# EAGLE design pid driver (EAGLE 9.5.1)

## Sheet 1 of 2
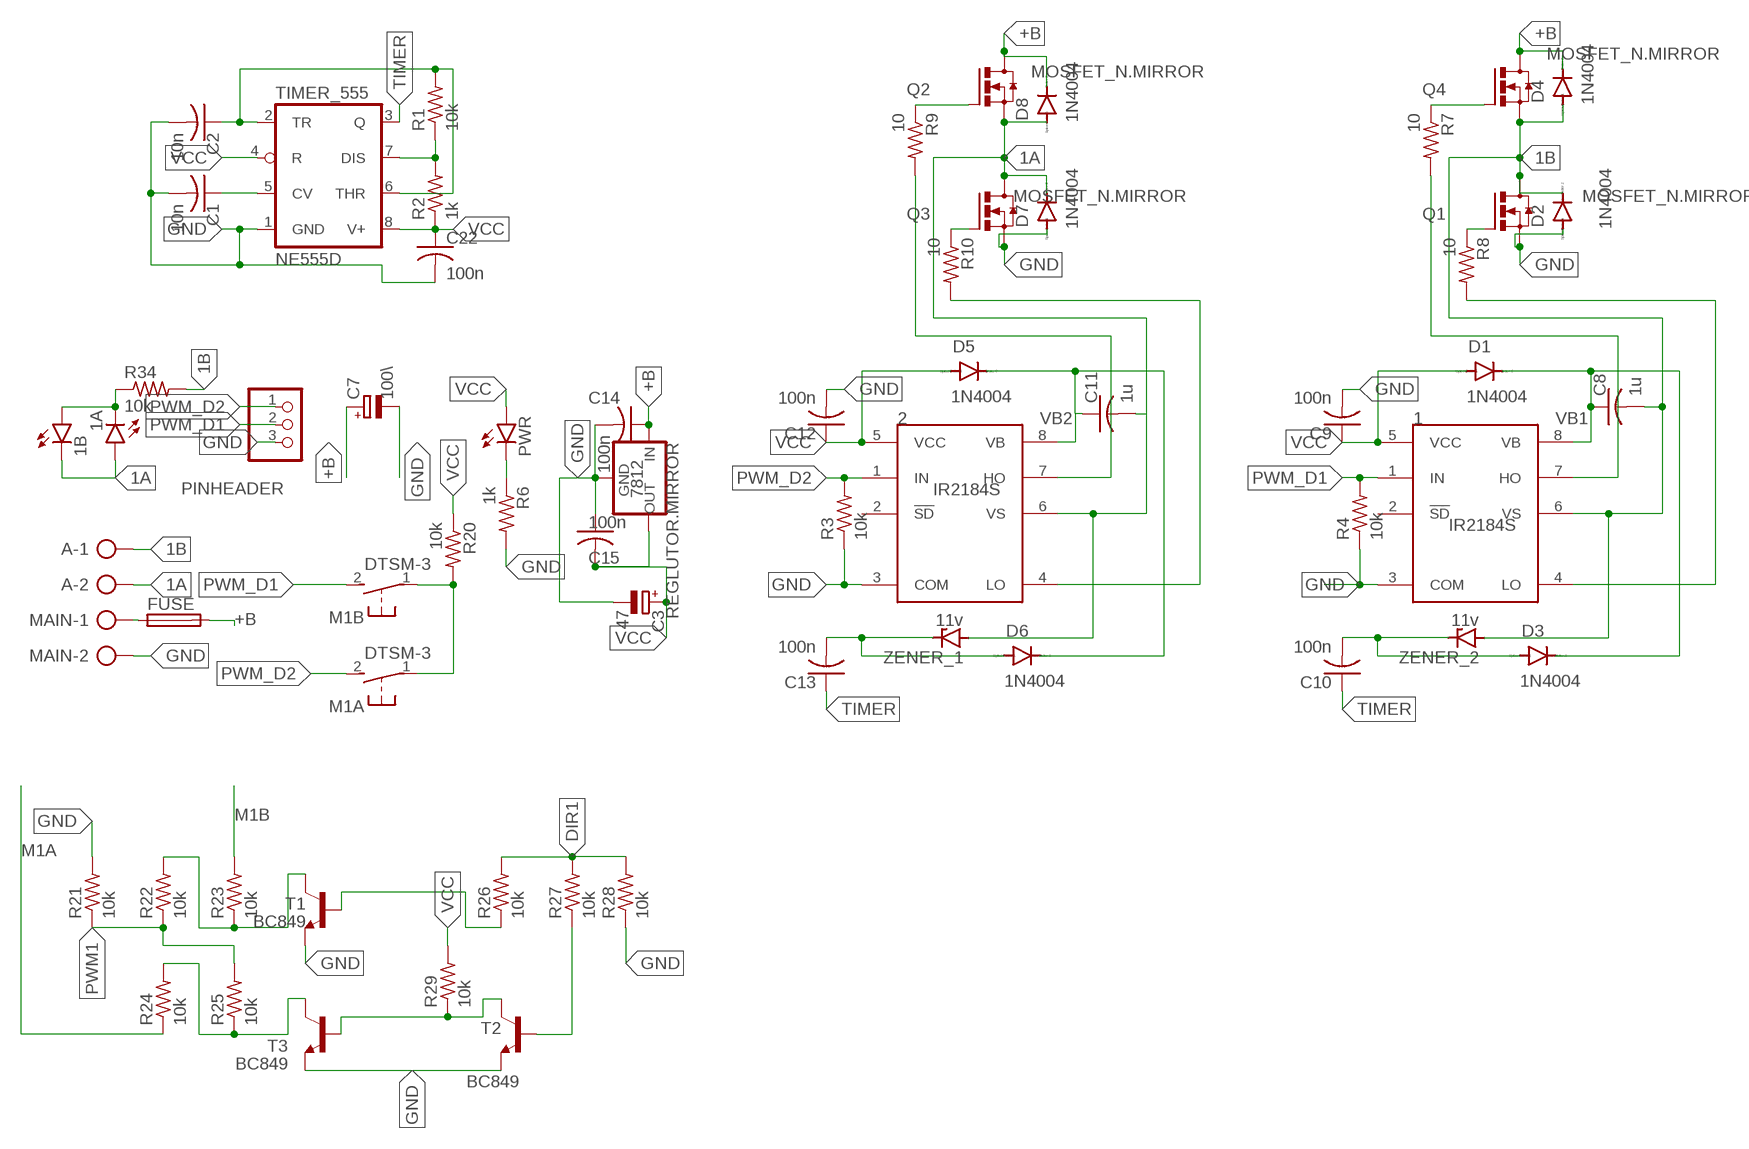
[diagram p0: schematic, sheet 1]

### Parts
1  IR2184S  [SO08]
1A  LEDCHIPLED_1206  [CHIPLED_1206]
1B  LEDCHIPLED_1206  [CHIPLED_1206]
2  IR2184S  [SO08]
7812  REGLUTOR.MIRROR  [78XXL.MIRROR]
A  AK300/22  [XTALRR488W60L1090T465H350B]
C1  10n  C-USC1206K  [C1206K]
C2  10n  C-USC1206K  [C1206K]
C3  47  CPOL-EUE5-10.5  [E5-10,5]
C7  100\  CPOL-EUE5-10.5  [E5-10,5]
C8  1u  C-USC1206K  [C1206K]
C9  100n  C-USC1206K  [C1206K]
C10  100n  C-USC1206K  [C1206K]
C11  1u  C-USC1206K  [C1206K]
C12  100n  C-USC1206K  [C1206K]
C13  100n  C-USC1206K  [C1206K]
C14  100n  C-USC1206K  [C1206K]
C15  100n  C-USC1206K  [C1206K]
C22  100n  C-USC1206K  [C1206K]
D1  1N4004  [DO41-10]
D2  1N4004  [DO41-10]
D3  1N4004  [DO41-10]
D4  1N4004  [DO41-10]
D5  1N4004  [DO41-10]
D6  1N4004  [DO41-10]
D7  1N4004  [DO41-10]
D8  1N4004  [DO41-10]
FUSE  FUSE_HOLDER  [SH22,5A]
M1A  DTSM-3  [DTSM-3]
M1B  DTSM-3  [DTSM-3]
MAIN  AK300/22  [XTALRR488W60L1090T465H350B]
PINHEADER  PINHD-1X3  [1X03]
PWR  LEDCHIPLED_1206  [CHIPLED_1206]
Q1  MOSFET_N.MIRROR  [TO220.MIRROR]
Q2  MOSFET_N.MIRROR  [TO220.MIRROR]
Q3  MOSFET_N.MIRROR  [TO220.MIRROR]
Q4  MOSFET_N.MIRROR  [TO220.MIRROR]
R1  10k  R-US_M1206  [M1206]
R2  1k  R-US_M1206  [M1206]
R3  10k  R-US_M1206  [M1206]
R4  10k  R-US_M1206  [M1206]
R6  1k  R-US_M1206  [M1206]
R7  10  R-US_M1206  [M1206]
R8  10  R-US_M1206  [M1206]
R9  10  R-US_M1206  [M1206]
R10  10  R-US_M1206  [M1206]
R20  10k  R-US_M1206  [M1206]
R21  10k  R-US_R1206  [R1206]
R22  10k  R-US_R1206  [R1206]
R23  10k  R-US_R1206  [R1206]
R24  10k  R-US_R1206  [R1206]
R25  10k  R-US_R1206  [R1206]
R26  10k  R-US_R1206  [R1206]
R27  10k  R-US_R1206  [R1206]
R28  10k  R-US_R1206  [R1206]
R29  10k  R-US_R1206  [R1206]
R34  10k  R-US_M1206  [M1206]
T1  BC849  [SOT23]
T2  BC849  [SOT23]
T3  BC849  [SOT23]
TIMER_555  NE555D  [SO08]
ZENER_1  11v  BZD23  [SOD81]
ZENER_2  11v  BZD23  [SOD81]

### Nets
1A: 1A.A 1B.C 2.6(VS) A.2 C11.2 D7.C D8.A Q2.S Q3.D ZENER_1.A
1B: 1.6(VS) A.1 C8.2 D2.C D4.A Q1.D Q4.S R34.2 ZENER_2.A
+B: 7812.IN C7.+ C14.1 D4.C D8.C FUSE.2 Q2.D Q4.D
DIR1: R26.2 R27.2 R28.2
GND: 1.3(COM) 2.3(COM) 7812.GND C1.2 C2.2 C3.- C7.- C9.2 C12.2 C14.2 C15.1 C22.2 D2.A D7.A MAIN.2 PINHEADER.3 Q1.S Q3.S R3.1 R4.1 R6.2 R21.2 R28.1 T1.2(E) T2.2(E) T3.2(E) TIMER_555.1(GND)
M1A: R24.1
M1B: R23.2
N$1: PWR.C R6.1
N$2: C1.1 TIMER_555.5(CV)
N$3: R1.1 R2.2 TIMER_555.7(DIS)
N$4: C2.1 R1.2 TIMER_555.2(TR) TIMER_555.6(THR)
N$7: M1A.1 M1B.1 R20.2
N$9: Q4.G R7.1
N$10: Q1.G R8.1
N$12: 1.4(LO) R8.2
N$13: 1.7(HO) R7.2
N$14: C10.2 D3.A ZENER_2.C
N$15: Q3.G R10.1
N$16: Q2.G R9.1
N$17: 2.4(LO) R10.2
N$18: 2.7(HO) R9.2
N$20: C13.2 D6.A ZENER_1.C
N$22: FUSE.1 MAIN.1
N$24: R24.2 R25.1 T3.3(C)
N$25: R22.2 R23.1 T1.3(C)
N$26: R26.1 T1.1(B)
N$27: R29.1 T2.3(C) T3.1(B)
N$28: R27.1 T2.1(B)
N$45: 1A.C 1B.A R34.1
PWM1: R21.1 R22.1 R25.2
PWM_D1: 1.1(IN) M1B.2 PINHEADER.2 R4.2 ; also sheet 2
PWM_D2: 2.1(IN) M1A.2 PINHEADER.1 R3.2 ; also sheet 2
TIMER: C10.1 C13.1 TIMER_555.3(Q)
VB1: 1.8(VB) C8.1 D1.C D3.C
VB2: 2.8(VB) C11.1 D5.C D6.C
VCC: 1.5(VCC) 2.5(VCC) 7812.OUT C3.+ C9.1 C12.1 C15.2 C22.1 D1.A D5.A PWR.A R2.1 R20.1 R29.2 TIMER_555.4(R) TIMER_555.8(V+)
Unconnected: 1.2(!SD) 2.2(!SD)

## Sheet 2 of 2
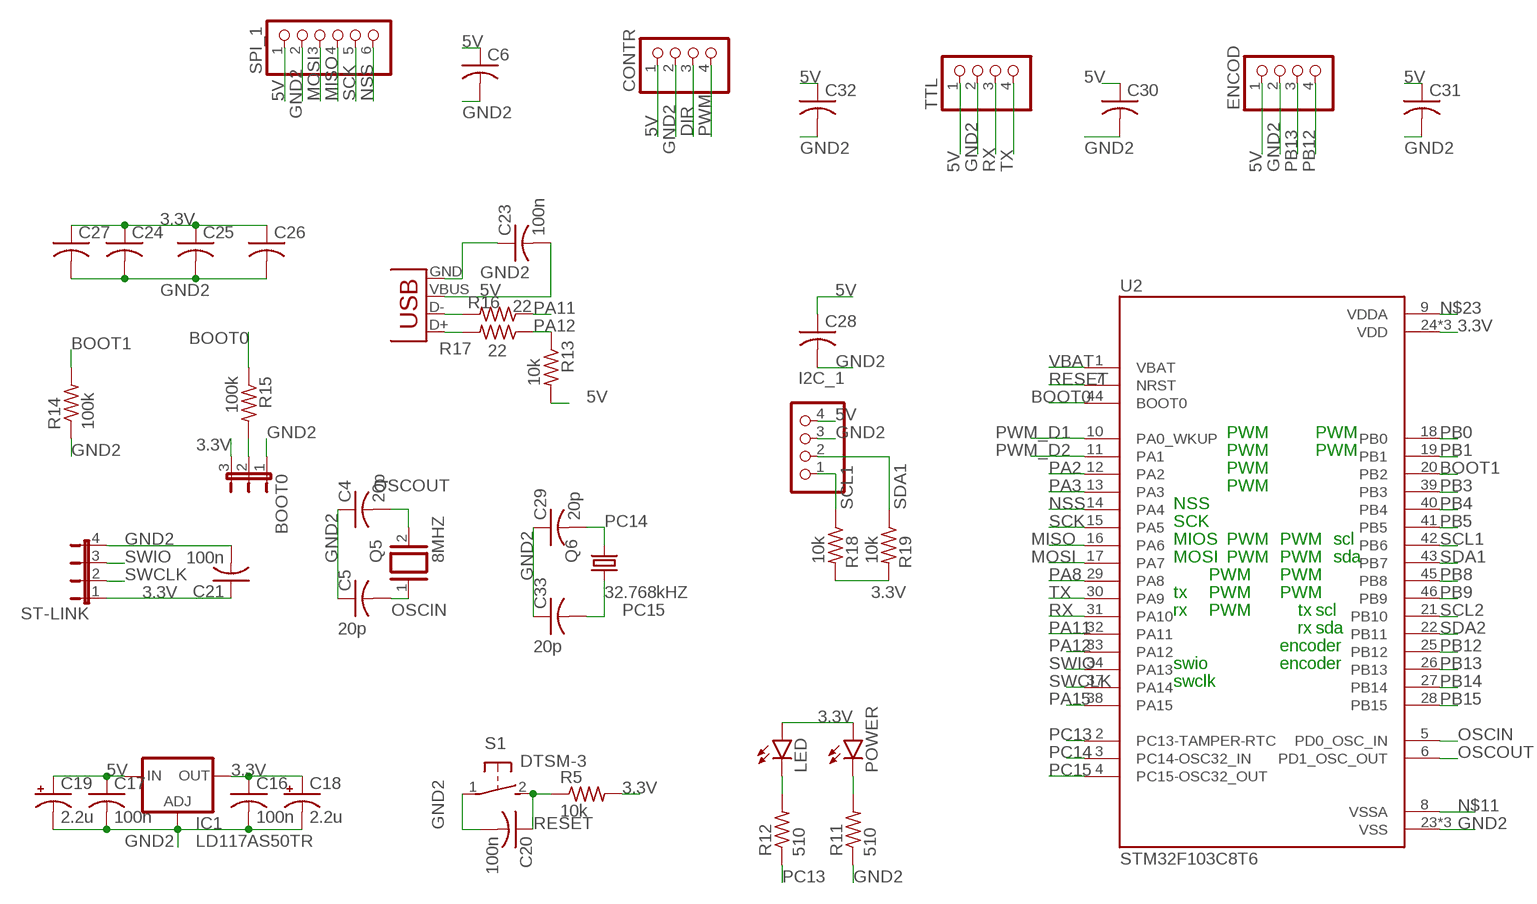
[diagram p1: schematic, sheet 2]

### Parts
BOOT0  JP2E  [JP2]
C4  20p  C-USC1206  [C1206]
C5  20p  C-USC1206  [C1206]
C6  C-USC1206  [C1206]
C16  100n  C-USC1206  [C1206]
C17  100n  C-USC1206  [C1206]
C18  2.2u  CPOL-USE2-5  [E2-5]
C19  2.2u  CPOL-USE2-5  [E2-5]
C20  100n  C-USC1206  [C1206]
C21  100n  C-USC1206  [C1206]
C23  100n  C-USC1206  [C1206]
C24  C-USC1206  [C1206]
C25  C-USC1206  [C1206]
C26  C-USC1206  [C1206]
C27  C-USC1206  [C1206]
C28  C-USC1206  [C1206]
C29  20p  C-USC1206  [C1206]
C30  C-USC1206  [C1206]
C31  C-USC1206  [C1206]
C32  C-USC1206  [C1206]
C33  20p  C-USC1206  [C1206]
CONTR  PINHD-1X4  [1X04]
ENCOD  PINHD-1X4  [1X04]
I2C_1  PINHD-1X4  [1X04]
IC1  LD117AS50TR  [SOT223]
LED  LEDCHIPLED_1206  [CHIPLED_1206]
POWER  LEDCHIPLED_1206  [CHIPLED_1206]
Q5  8MHZ  XTAL/S  [QS]
Q6  32.768kHZ  CRYSTALTC26H  [TC26H]
R5  10k  R-US_R1206  [R1206]
R11  510  R-US_R1206  [R1206]
R12  510  R-US_R1206  [R1206]
R13  10k  R-US_R1206  [R1206]
R14  100k  R-US_R1206  [R1206]
R15  100k  R-US_R1206  [R1206]
R16  22  R-US_R1206  [R1206]
R17  22  R-US_R1206  [R1206]
R18  10k  R-US_R1206  [R1206]
R19  10k  R-US_R1206  [R1206]
S1  DTSM-3  [DTSM-3]
SPI_1  PINHD-1X6  [1X06]
ST-LINK  JP4E  [JP4]
TTL  PINHD-1X4  [1X04]
U2  STM32F103C8T6  [QFP50P900X900X160-48N]
X1  USB-MB-S  [USB-MB-S]

### Nets
3.3V: BOOT0.3 C16.1 C18.+ C21.1 C24.1 C25.1 C26.1 C27.1 IC1.4(OUT) LED.A POWER.A R5.2 R18.2 R19.2 ST-LINK.1 U2.24(VDD) U2.36(VDD) U2.48(VDD)
5V: C6.1 C17.1 C19.+ C23.2 C28.1 C30.1 C31.1 C32.1 CONTR.1 ENCOD.1 I2C_1.4 IC1.3(IN) R13.2 SPI_1.1 TTL.1 X1.VBUS
BOOT0: R15.1 U2.44(BOOT0)
BOOT1: R14.2 U2.20(PB2)
DIR: CONTR.3
GND2: BOOT0.1 C4.1 C5.1 C6.2 C16.2 C17.2 C18.- C19.- C20.2 C21.2 C23.1 C24.2 C25.2 C26.2 C27.2 C28.2 C29.1 C30.2 C31.2 C32.2 C33.1 CONTR.2 ENCOD.2 I2C_1.3 IC1.1(ADJ) R11.1 R14.1 S1.1 SPI_1.2 ST-LINK.4 TTL.2 U2.23(VSS) U2.35(VSS) U2.47(VSS) X1.GND
MISO: SPI_1.4 U2.16(PA6)
MOSI: SPI_1.3 U2.17(PA7)
N$5: LED.C R12.2
N$6: POWER.C R11.2
N$8: BOOT0.2 R15.2
N$11: U2.8(VSSA)
N$19: R16.2 X1.D-
N$21: R17.2 X1.D+
N$23: U2.9(VDDA)
NSS: SPI_1.6 U2.14(PA4)
OSCIN: C5.2 Q5.1 U2.5(PD0_OSC_IN)
OSCOUT: C4.2 Q5.2 U2.6(PD1_OSC_OUT)
PA2: U2.12(PA2)
PA3: U2.13(PA3)
PA8: U2.29(PA8)
PA11: R16.1 U2.32(PA11)
PA12: R13.1 R17.1 U2.33(PA12)
PA15: U2.38(PA15)
PB0: U2.18(PB0)
PB1: U2.19(PB1)
PB3: U2.39(PB3)
PB4: U2.40(PB4)
PB5: U2.41(PB5)
PB8: U2.45(PB8)
PB9: U2.46(PB9)
PB12: ENCOD.4 U2.25(PB12)
PB13: ENCOD.3 U2.26(PB13)
PB14: U2.27(PB14)
PB15: U2.28(PB15)
PC13: R12.1 U2.2(PC13-TAMPER-RTC)
PC14: C29.2 Q6.2 U2.3(PC14-OSC32_IN)
PC15: C33.2 Q6.1 U2.4(PC15-OSC32_OUT)
PWM: CONTR.4
PWM_D1: U2.10(PA0_WKUP) ; also sheet 1
PWM_D2: U2.11(PA1) ; also sheet 1
RESET: C20.1 R5.1 S1.2 U2.7(NRST)
RX: TTL.3 U2.31(PA10)
SCK: SPI_1.5 U2.15(PA5)
SCL1: I2C_1.1 R18.1 U2.42(PB6)
SCL2: U2.21(PB10)
SDA1: I2C_1.2 R19.1 U2.43(PB7)
SDA2: U2.22(PB11)
SWCLK: ST-LINK.2 U2.37(PA14)
SWIO: ST-LINK.3 U2.34(PA13)
TX: TTL.4 U2.30(PA9)
VBAT: U2.1(VBAT)

### Notes on the sheet
- PWM | PWM
- PWM | PWM
- PWM
- PWM
- NSS
- SCK
- MIOS | PWM | PWM | scl
- MOSI | PWM | PWM | sda
- PWM | PWM
- tx | PWM | PWM
- rx | PWM | tx | scl
- rx | sda
- encoder
- swio | encoder
- swclk

## Library data of the parts
1 2 = irs:IR2184
1A 1B LED POWER PWR = led:LED: LED OSRAM: - CHIPLED LG R971, LG N971, LY N971, LG Q971, LY Q971, LO R971, LY R971 LH N974, LH R974 LS Q976, LO Q976, LY Q976 LO Q996 - Hyper CHIPLED LW Q18S LB Q993, LB Q99A, LB R99A - SideLED LS A670, LO A670, LY A670, LG A670, LP A670 LB A673, LV A673, LT A673, LW A673 LH A674 LY A675 LS A676, LA A676, LO A676, LY A676, LW A676 LS A679, LY A679, LG A679 - Hyper Micro SIDELED® LS Y876, LA Y876, LO Y876, LY Y876 LT Y87S - SmartLED LW L88C, LW L88S LB L89C, LB L89S, LG L890 LS L89K, LO L89K, LY L89K LS L896, LA L896, LO L896, LY L896 - TOPLED LS T670, LO T670, LY T670, LG T670, LP T670 LSG T670, LSP T670, LSY T670, LOP T670, LYG T670 LG T671, LOG T671, LSG T671 LB T673, LV T673, LT T673, LW T673 LH T674 LS T676, LA T676, LO T676, LY T676, LB T676, LH T676, LSB T676, LW T676 LB T67C, LV T67C, LT T67C, LS T67K, LO T67K, LY T67K, LW E67C LS E67B, LA E67B, LO E67B, LY E67B, LB E67C, LV E67C, LT E67C LW T67C LS T679, LY T679, LG T679 LS T770, LO T770, LY T770, LG T770, LP T770 LB T773, LV T773, LT T773, LW T773 LH T774 LS E675, LA E675, LY E675, LS T675 LS T776, LA T776, LO T776, LY T776, LB T776 LHGB T686 LT T68C, LB T68C - Hyper Mini TOPLED® LB M676 - Mini TOPLED Santana® LG M470 LS M47K, LO M47K, LY M47K Source: http://www.osram.convergy.de LUXEON: - LUMILED® LXK2-PW12-R00, LXK2-PW12-S00, LXK2-PW14-U00, LXK2-PW14-V00 LXK2-PM12-R00, LXK2-PM12-S00, LXK2-PM14-U00 LXK2-PE12-Q00, LXK2-PE12-R00, LXK2-PE12-S00, LXK2-PE14-T00, LXK2-PE14-U00 LXK2-PB12-K00, LXK2-PB12-L00, LXK2-PB12-M00, LXK2-PB14-N00, LXK2-PB14-P00, LXK2-PB14-Q00 LXK2-PR12-L00, LXK2-PR12-M00, LXK2-PR14-Q00, LXK2-PR14-R00 LXK2-PD12-Q00, LXK2-PD12-R00, LXK2-PD12-S00 LXK2-PH12-R00, LXK2-PH12-S00 LXK2-PL12-P00, LXK2-PL12-Q00, LXK2-PL12-R00 Source: www.luxeon.com KINGBRIGHT: KA-3528ASYC Source: www.kingbright.com
7812 = MOSFET MIRROR:REGLUTOR.MIRROR
A MAIN = con-ptr50056:AK300/2: CONNECTOR
BOOT0 = jumper:JP2E: JUMPER
C1 C2 C4-C6 C8-C17 C20-C33 = rcl:C-US: CAPACITOR, American symbol; SPICEPREFIX: C
C3 C7 = rcl8:CPOL-EU: POLARIZED CAPACITOR, European symbol; SPICEPREFIX: C
C18 C19 = rcl:CPOL-US: POLARIZED CAPACITOR, American symbol; SPICEPREFIX: C
CONTR ENCOD TTL = MIA_LIBRARY (2):PINHD-1X4: PIN HEADER
D1-D8 = diode:1N4004: DIODE general purpose rectifier, 1 A
FUSE = MIA_LIBRARY (2):FUSE_HOLDER
I2C_1 = pinhead:PINHD-1X4: PIN HEADER
IC1 = v-reg:LD117A?*: Low drop fixed and adjustable positive voltage regulators 1 A Source: http://www.st.com/stonline/products/literature/ds/7194/ld1117axx.pdf
M1A M1B S1 = switch-tact:DTSM-3
PINHEADER = pinhead:PINHD-1X3: PIN HEADER
Q1-Q4 = MIA_LIBRARY (5):MOSFET_N.MIRROR
Q5 = special:XTAL/S: CRYSTAL
Q6 = crystal:CRYSTAL: CRYSTAL; OC_FARNELL: unknown; OC_NEWARK: unknown
R1-R29 R34 = rcl:R-US_: RESISTOR, American symbol; SPICEPREFIX: R
SPI_1 = pinhead:PINHD-1X6: PIN HEADER
ST-LINK = jumper:JP4E: JUMPER
T1-T3 = transistor-neu-to92:BC849: NPN TRANSISTOR
TIMER_555 = linear:*555: TIMER
U2 = STM32F103C8T6:STM32F103C8T6: Mainstream Performance line, ARM Cortex-M3 MCU with 64 Kbytes Flash, 72 MHz CPU, motor control, USB and CAN; AVAILABILITY: Unavailable; DESCRIPTION: Mainstream Performance line, ARM Cortex-M3 MCU with 64 Kbytes Flash, 72 MHz CPU, motor control, USB and CAN; MF: STMicroelectronics; MP: STM32F103C8T6; PACKAGE: LQFP-48 STMicroelectronics; PRICE: None
X1 = MIA_LIBRARY (2):USB: USB Connectors
ZENER_1 ZENER_2 = diode:BZD23: Z DIODE

## Board
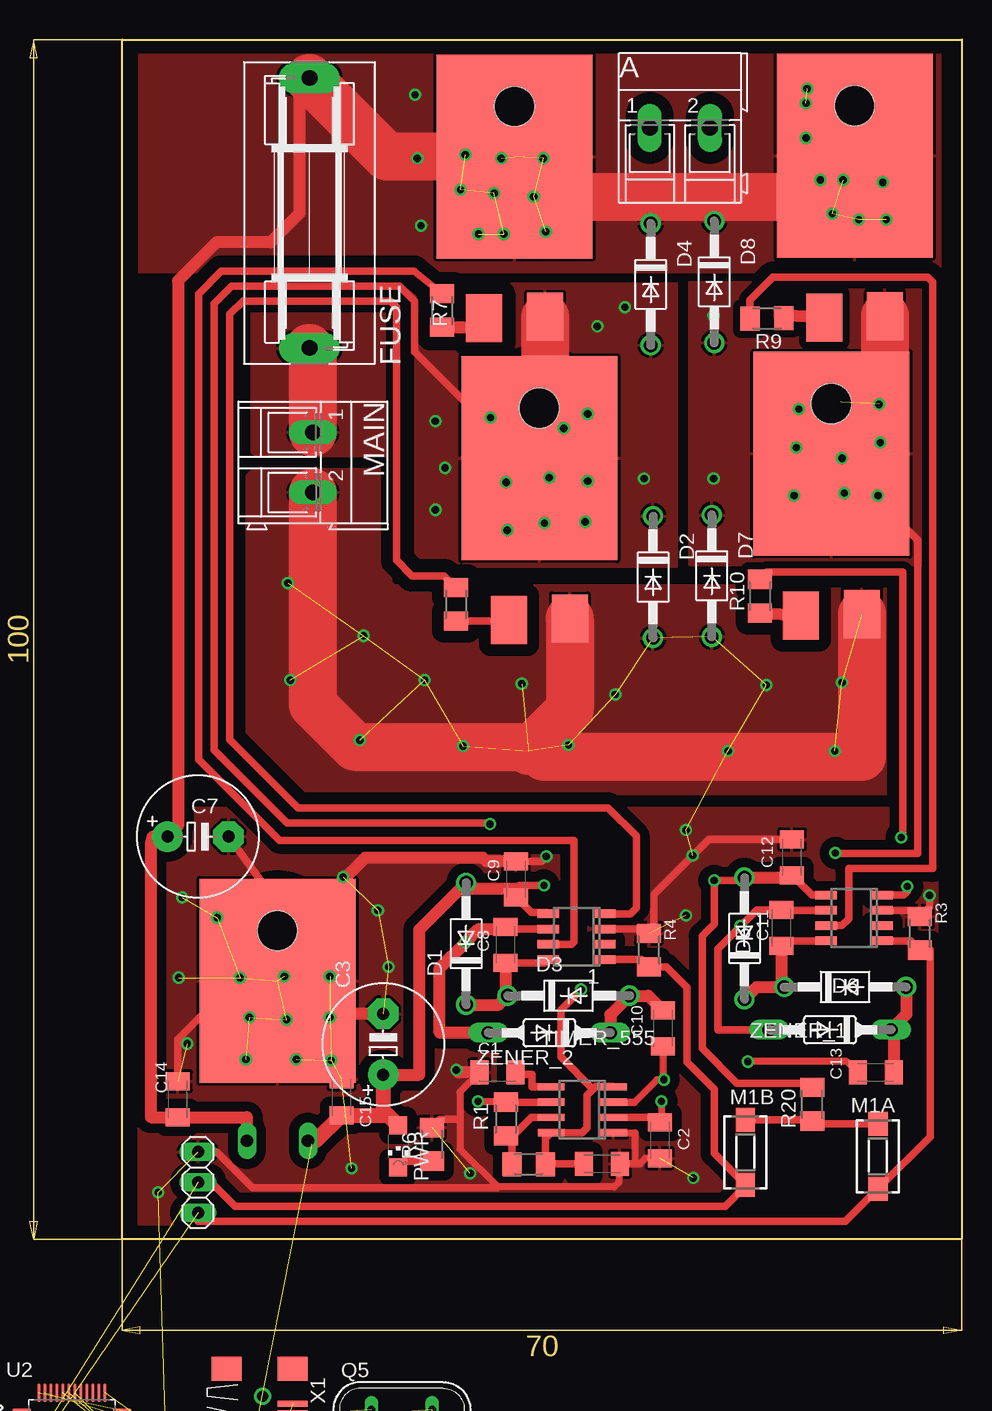
[diagram p2: board, top side]
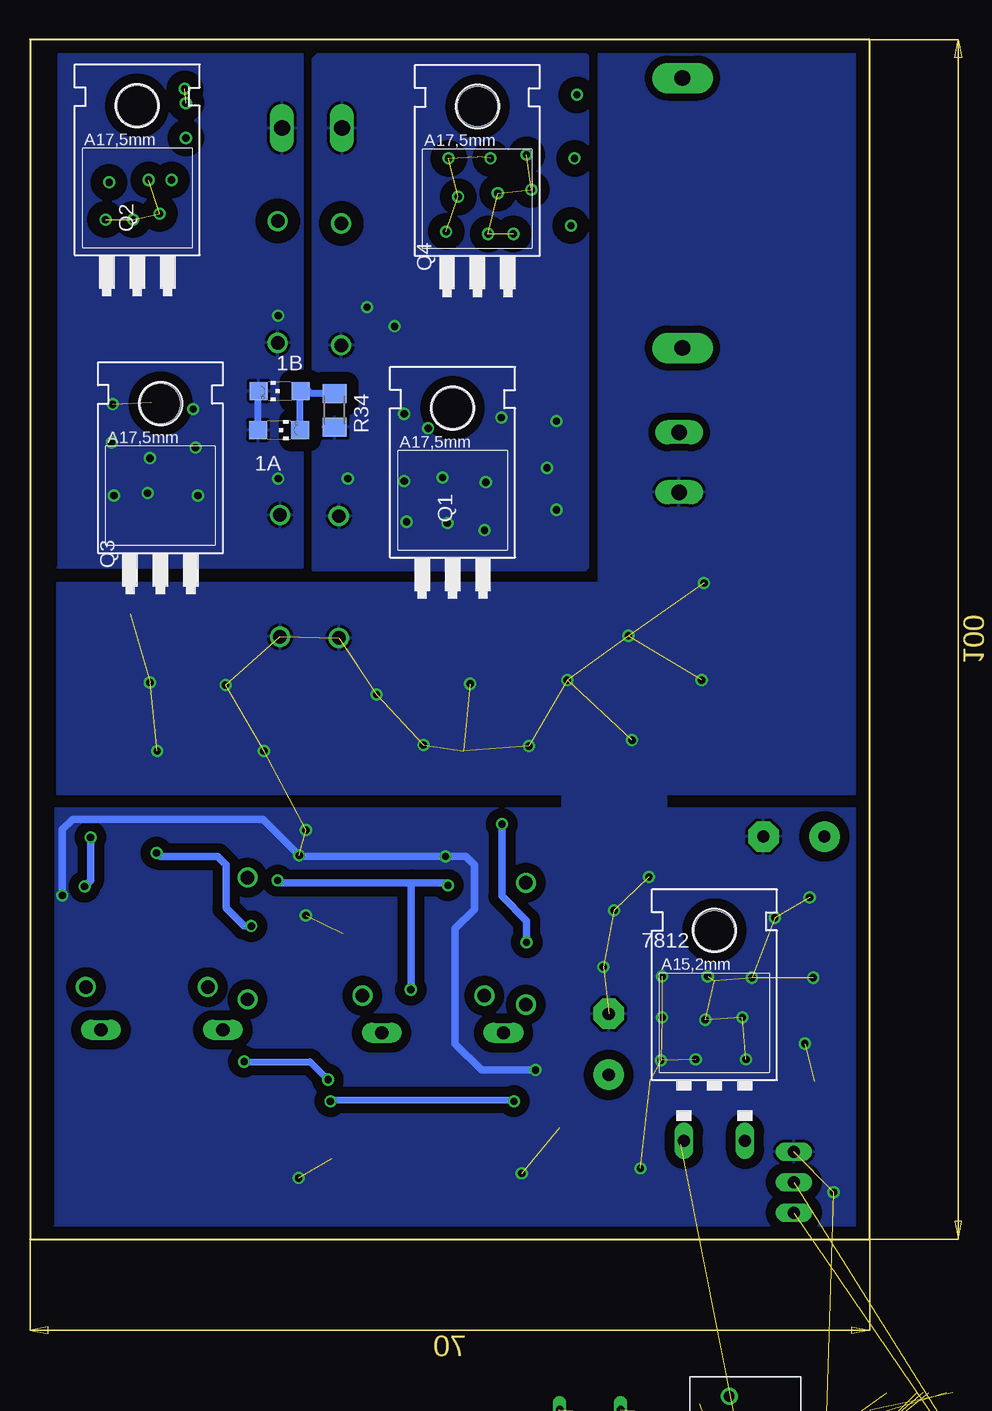
[diagram p3: board, bottom side, seen from below]

Size 70 x 100 mm. Coordinates in mm from the lower left corner, seen from the top.
Outline: 0,0 0,100 70,100 70,0 0,0
Copper layers (1*16): Top 0.035mm / dielectric 1.5mm / Bottom 0.035mm
Design rules "default *": minimum track width 0.015240625mm, minimum drill 0.8mm, track to track 0.6mm, track to pad 0.6mm, pad to pad 0.4mm, via to via 6mil, smd to smd 6mil, copper to edge 40mil, drill to drill 6mil, minimum pad ring 10mil, minimum via ring 8mil, stop-mask expansion 4mil, vias tented up to drill 0mil, thermal gap 10mil

### Footprints (pad centres in the part's own frame; a part is rotated, then mirrored left to right if it is on the bottom)
SO08 = smd 0.72 x 1.78: 1 -1.905,-2.35; 2 -0.635,-2.35; 3 0.635,-2.35; 4 1.905,-2.35; 5 1.905,2.35; 6 0.635,2.35; 7 -0.635,2.35; 8 -1.905,2.35
CHIPLED_1206 = smd 1.5 x 1.5: A 0,-1.75; C 0,1.75
78XXL.MIRROR = smd 13 x 17 bottom: GND 0,7 | drill 1.016 long: IN 2.54,-6.35; OUT -2.54,-6.35 | hole 3.302: 0,11.176
XTALRR488W60L1090T465H350B = drill 1.321 long: 1 -2.515,-1.27; 2 2.489,-1.27
JP2 = drill 0.914 long: 1 -2.54,0; 2 0,0; 3 2.54,0
C1206K = smd 1.5 x 2: 1 -1.5,0; 2 1.5,0
E5-10,5 = drill 1.016 pad 2.54: + -2.54,0 | drill 1.016 pad 2.54 octagon: - 2.54,0
C1206 = smd 1.6 x 1.8: 1 -1.4,0; 2 1.4,0
E2-5 = drill 0.813 pad 1.27: + -1.016,0 | drill 0.813 pad 1.27 octagon: - 1.016,0
1X04 = drill 1.016 long: 1 -3.81,0; 2 -1.27,0; 3 1.27,0; 4 3.81,0
DO41-10 = drill 1.118: A 5.08,0; C -5.08,0
SH22,5A = drill 1.321 pad 2.54 long: 1 -11.252,0; 2 11.252,0
SOT223 = smd 1.5 x 2: 1 -2.3,-3.15; 2 0,-3.15; 3 2.3,-3.15 | smd 3.8 x 2: 4 0,3.15
DTSM-3 = smd 2 x 1.6: 1 -2.7,0; 2 2.7,0
1X03 = drill 1.016 long: 1 -2.54,0; 2 0,0; 3 2.54,0
TO220.MIRROR = smd 13 x 17 bottom: D 0,7 | smd 3 x 4 bottom: G 2.54,-6.477; S -2.54,-6.35 | hole 3.302: 0,11.176
QS = drill 0.61 long: 1 -2.54,0; 2 2.54,0
TC26H = drill 0.813: 1 -1.27,0; 2 1.27,0
M1206 = smd 1.6 x 2: 1 -1.4,0; 2 1.4,0
R1206 = smd 1.6 x 1.803: 1 -1.422,0; 2 1.422,0
1X06 = drill 1.016 long: 1 -6.35,0; 2 -3.81,0; 3 -1.27,0; 4 1.27,0; 5 3.81,0; 6 6.35,0
JP4 = drill 0.914 long: 1 -3.81,0; 2 -1.27,0; 3 1.27,0; 4 3.81,0
SOT23 = smd 1 x 1.4: 1 -0.95,-1.1; 2 0.95,-1.1; 3 0,1.1
SO08' = smd 0.6 x 2.2: 1 -1.905,-2.6; 2 -0.635,-2.6; 3 0.635,-2.6; 4 1.905,-2.6; 5 1.905,2.6; 6 0.635,2.6; 7 -0.635,2.6; 8 -1.905,2.6
QFP50P900X900X160-48N = smd 1.56 x 0.28: 1 -4.18,2.75; 2 -4.18,2.25; 3 -4.18,1.75; 4 -4.18,1.25; 5 -4.18,0.75; 6 -4.18,0.25; 7 -4.18,-0.25; 8 -4.18,-0.75; 9 -4.18,-1.25; 10 -4.18,-1.75; 11 -4.18,-2.25; 12 -4.18,-2.75; 25 4.18,-2.75; 26 4.18,-2.25; 27 4.18,-1.75; 28 4.18,-1.25; 29 4.18,-0.75; 30 4.18,-0.25; 31 4.18,0.25; 32 4.18,0.75; 33 4.18,1.25; 34 4.18,1.75; 35 4.18,2.25; 36 4.18,2.75 | smd 0.28 x 1.56: 13 -2.75,-4.18; 14 -2.25,-4.18; 15 -1.75,-4.18; 16 -1.25,-4.18; 17 -0.75,-4.18; 18 -0.25,-4.18; 19 0.25,-4.18; 20 0.75,-4.18; 21 1.25,-4.18; 22 1.75,-4.18; 23 2.25,-4.18; 24 2.75,-4.18; 37 2.75,4.18; 38 2.25,4.18; 39 1.75,4.18; 40 1.25,4.18; 41 0.75,4.18; 42 0.25,4.18; 43 -0.25,4.18; 44 -0.75,4.18; 45 -1.25,4.18; 46 -1.75,4.18; 47 -2.25,4.18; 48 -2.75,4.18
USB-MB-S = smd 2.5 x 0.5: D+ 2.5,0; D- 2.5,0.8; GND 2.5,-1.6; ID 2.5,-0.8; VBUS 2.5,1.6 | smd 2.5 x 2: P$1 -3,-4.5; P$2 -3,4.5; P$3 2.5,-4.4; P$4 2.5,4.5 | drill 0.9: P$5 0,2.2; P$6 0,-2.2
SOD81 = drill 1.118 long: A 5.08,0; C -5.08,0

### Placement (x,y rotation side)
1  37.87,25.22 90 top
1A  49.23,67.45 270 bottom
1B  49.17,70.7 90 bottom
2  61.01,26.78 90 top
7812  12.93,14.55 0 bottom
A  46.5,93.9 0 top
BOOT0  30.4,-28 0 top  (outside the outline)
C1  31.27,13.9 180 top
C2  44.8,8.25 270 top
C3  21.75,16.25 90 top
C4  31.7,-36.4 0 top  (outside the outline)
C5  -8,-42.6 0 top  (outside the outline)
C6  7.1,-60.5 0 top  (outside the outline)
C7  6.31,33.57 0 top
C8  31.96,24.55 90 top
C9  32.82,30 90 top
C10  45.07,17.59 90 top
C11  54.94,25.95 90 top
C12  55.83,31.84 90 top
C13  62.8,13.92 0 top
C14  4.62,11.66 90 top
C15  18.27,11.84 270 top
C16  -8,-36.4 0 top  (outside the outline)
C17  -2.3,-36.4 0 top  (outside the outline)
C18  2.2,-48.5 0 top  (outside the outline)
C19  11.4,-48.5 0 top  (outside the outline)
C20  3.4,-36.4 0 top  (outside the outline)
C21  9.1,-36.4 0 top  (outside the outline)
C22  40,6.3 0 top
C23  14.8,-36.4 0 top  (outside the outline)
C24  12.1,-60.5 0 top  (outside the outline)
C25  17.1,-60.5 0 top  (outside the outline)
C26  22.1,-60.5 0 top  (outside the outline)
C27  27.1,-60.5 0 top  (outside the outline)
C28  32.1,-60.5 0 top  (outside the outline)
C29  -8,-79.1 0 top  (outside the outline)
C30  -3,-65.9 0 top  (outside the outline)
C31  2,-65.9 0 top  (outside the outline)
C32  7,-65.9 0 top  (outside the outline)
C33  -3,-79.1 0 top  (outside the outline)
CONTR  -4.8,-55.6 0 top  (outside the outline)
D1  28.66,24.63 90 top
D2  44.25,55.2 270 top
D3  37.2,20.3 0 top
D4  44.05,79.6 270 top
D5  51.87,25.07 90 top
D6  60.26,21.02 0 top
D7  49.15,55.3 270 top
D8  49.35,79.8 270 top
ENCOD  6.1,-55.6 0 top  (outside the outline)
FUSE  15.6,85.55 90 top
I2C_1  17,-55.6 0 top  (outside the outline)
IC1  5.5,-28.8 0 top  (outside the outline)
LED  3.5,-60.1 0 top  (outside the outline)
M1A  63,6.9 270 top
M1B  51.95,7.25 270 top
MAIN  17.15,64.75 270 top
PINHEADER  6.31,4.74 90 top
POWER  1.1,-30.6 0 top  (outside the outline)
PWR  23,7.76 180 top
Q1  34.76,58.1 0 bottom
Q2  61.05,83.31 0 bottom
Q3  59.12,58.48 0 bottom
Q4  32.7,83.25 0 bottom
Q5  23.3,-14.2 0 top  (outside the outline)
Q6  -4.7,-71.5 0 top  (outside the outline)
R1  31.98,10.02 90 top
R2  33.88,6.26 180 top
R3  66.5,25.5 270 top
R4  43.9,24.1 270 top
R5  -3,-42.6 0 top  (outside the outline)
R6  25.81,7.91 90 top
R7  26.66,77.42 90 top
R8  27.81,52.92 90 top
R9  53.74,76.76 180.1 top
R10  53.15,53.61 90 top
R11  2,-42.6 0 top  (outside the outline)
R12  7,-42.6 0 top  (outside the outline)
R13  12,-42.6 0 top  (outside the outline)
R14  20.5,-36.4 0 top  (outside the outline)
R15  26.1,-36.4 0 top  (outside the outline)
R16  17,-42.6 0 top  (outside the outline)
R17  22,-42.6 0 top  (outside the outline)
R18  27,-42.6 0 top  (outside the outline)
R19  32,-42.6 0 top  (outside the outline)
R20  57.51,11.25 270 top
R21  -8,-92.7 0 top  (outside the outline)
R22  -3,-92.7 0 top  (outside the outline)
R23  2,-92.7 0 top  (outside the outline)
R24  7,-92.7 0 top  (outside the outline)
R25  -8,-98.9 0 top  (outside the outline)
R26  -3,-98.9 0 top  (outside the outline)
R27  2,-98.9 0 top  (outside the outline)
R28  7,-98.9 0 top  (outside the outline)
R29  -8,-105.1 0 top  (outside the outline)
R34  44.6,69.1 270 bottom
S1  -6.7,-28.9 0 top  (outside the outline)
SPI_1  26.2,-49.4 0 top  (outside the outline)
ST-LINK  21.1,-28 0 top  (outside the outline)
T1  -8.1,-85.9 0 top  (outside the outline)
T2  -1.6,-85.9 0 top  (outside the outline)
T3  4.9,-85.9 0 top  (outside the outline)
TIMER_555  NE555D  [SO08']  38.35,10.79 90 top
TTL  -4.8,-61 0 top  (outside the outline)
U2  -4.2,-17 0 top  (outside the outline)
X1  11.7,-15.3 0 top  (outside the outline)
ZENER_1  59,17.45 180 top
ZENER_2  35.6,17.2 180 top

### Tracks (layer width: path | path; a pad name or v marks a point on that pad's centre or on a via)
1A  (via drill 0.6)  (1 unrouted)
  Top 0.61: 2.6 54.98,27.41 C11.2 52.9,27.45 v51.55,26.1 49.65,24.2 49.65,17.45 ZENER_1.A | 61.05,65.5 61.05,63.55 61.05,58.7 | Q3.D 66.3,58.3 66.3,32.15 59.5,32.15 v59.45,32.2
  Top 4: 61.05,62.5 63.45,62.5 63.45,65.1 63.35,65.2 60.95,65.2 60.95,63.7 61.55,63.1 61.75,63.1 61.75,63.4 59.75,63.4 59.75,62.4 58.75,62.4 58.55,62.2 58.55,61.9 60.25,60.2 62.15,60.2 62.15,65.5 61.05,65.5 | 61.05,63.55 Q3.D 57.75,64.11 57.75,61.3 | 61.05,65.6 61.05,62.5 | Q2.S 63.59,65.04 61.05,62.5
  Bottom 0.6: 1A.A 50.98,70.64 1B.C
  Bottom 0.61: v59.45,32.2 59.15,31.9 54.35,31.9 53.65,31.2 53.65,27.6 52.15,26.1 v51.55,26.1
  other vias: 49.3,63.4 49.3,77 59.9,69.8 56.4,69.2 56.2,66 56,62 63.1,69.6 63.2,66.4 60,65.1 60.2,62.2 63,62
  pour Top (isolate 0.61): 68.65,79.8 47.25,79.8 47.25,56.2 68.65,56.2
  pour Bottom (isolate 1.016): 47.25,56 47.25,98.8 67.65,98.8 67.65,56.1 67.75,56
1B  (via drill 0.6)
  Top 0.61: 1.6 32.16,25.86 C8.2 | Q1.D 33.26,65.1 24.35,74.01 24.35,78.2 23.1,79.45 9.1,79.45 7.65,78 7.65,40.8 13.75,34.7 30.65,34.7 v30.65,34.6
  Top 1.016: ZENER_2.A 26.45,17.2 26.45,22.6 v28.6,24.75 29.7,25.86 32.16,25.86
  Top 4: Q4.S 35.24,66.39 32.75,63.9 32.55,64.1 32.55,65.1 | Q1.D 32.55,65.1 | 32.55,65.8 32.55,65.1
  Bottom 0.61: v28.6,24.75 28.6,26.55 30.65,28.6 v30.65,34.6
  other vias: 39.6,76.1 41.9,77.7 26.1,68.2 26.9,64.3 26.1,60.8 43.5,63.4 30.7,68.5 32,63.1 32.1,59.1 35.6,63.5 35.2,59.7 38.6,59.8 38.8,63.2 38.8,68.8 36.8,67.6
  pour Top (isolate 1.13): 46.25,79.7 46.25,56.05 23.7,56.05 23.65,56 23.65,79.6 23.55,79.7
  pour Bottom (isolate 1.016): 46.45,55.8 23.65,55.8 23.45,56 23.45,98.6 23.65,98.8 46.05,98.8 46.45,98.4
3.3V  (17 unrouted)
5V  (15 unrouted)
+B  (via drill 0.6)  (12 unrouted)
  Top 0.61: Q2.D 57,94.36 v57,94.7 | Q2.D 59.56,91.8 v57,91.8 | Q2.D 61.05,94.15 61.2,94.3 61.2,91.3 v58.2,88.3 | Q2.D 60.1,89.36 v60.1,88.3 | v63.4,88.1 63.26,88.1 Q2.D
  Top 1.016: 7812.IN 10.39,10.16 C14.1 2.38,10.16 2.38,32.95 2.52,33.52 2.57,33.57 C7.+ 4.65,34.45 4.65,79.9 7.85,83.1 12.35,83.1 14.75,85.5 14.75,95.95 FUSE.2
  Top 4: Q2.D 57.63,86.89 36.05,86.89 Q4.D 22.05,90.25 15.6,96.7 FUSE.2
  other vias: 31,87.2 24.4,95.4 24.6,90.1 24.9,84.5 28.6,90.4 28.2,87.5 29.7,83.8 31.6,90.1 31.8,83.8 35.1,90.1 34.3,86.9 35.3,84 57.1,95.9 63.7,85 61.4,85 59.2,85.5
  pour Top (isolate 1.016): 1.35,99.5 1.35,80.6 68.25,80.6 68.25,99.4 68.15,99.5
BOOT0  (1 unrouted)
BOOT1  (1 unrouted)
DIR1  (2 unrouted)
GND  (via drill 0.6, 0.6 pad 0.6)  (43 unrouted)
  Top 0.6: C1.2 28.15,12.28 28.15,10 28.15,7.5 31.3,4.35 41,4.35 41.42,4.78 41.42,6.38 41.42,6.47 | TIMER_555.1 42.75,8.88 42.75,6.3 C22.2 | C2.2 43.6,6.75 43.15,6.3
  Top 0.61: 2.3 65.98,27.41 R3.1 67.3,27.7 v67.3,28.65 | 1.3 43.55,25.86 R4.1 44.3,25.9 44.3,28.75 v47.55,32 48.89,33.34 C12.2 | v35.35,31.9 34.95,31.5 C9.2 | 41.45,6.45 41.42,6.47 | 41.42,6.38 C22.2 43.15,6.3 | R6.2 26.5,10 28.15,10 | 20.25,31.8 12.93,24.48 7812.GND 12.93,27.95 C7.- | 11.12,23.14 4.62,16.64 C14.2 | PINHEADER.3 7.87,7.28 10.85,4.3 31.25,4.3 31.3,4.35
  Top 1.016: C1.2 28.05,13.9 v27.85,14.1 | 7812.GND 15.69,18.79 16.29,18.79 | 16.29,18.79 18.27,16.81 C15.1 | C3.- 16.29,18.79 | C9.2 30.35,31.5 30.05,31.8 20.25,31.8 11.59,23.14 11.12,23.14
  Top 4: Q1.S 37.3,44.15 34.2,41.05 | 34.2,41.05 34.1,40.95 | 34.1,40.95 33.85,40.7 | Q3.S 61.66,40.2 35.15,40.2 34.4,40.95 34.1,40.95 | MAIN.2 15.88,44.57 19.4,41.05 34.2,41.05
  Bottom 0.61: v67.3,28.65 67.3,34.15 66.45,35 50.55,35 v47.55,32 47.45,31.9 v35.35,31.9 33.65,31.9 32.95,31.2 32.95,27.5 34.55,25.9 34.55,16.3 32.35,14.1 v27.85,14.1
  other vias: 20.1,50.3 14,46.6 13.8,54.7 25.2,46.6 19.8,41.6 33.3,46.3 41.1,45.4 28.4,41.1 37.2,41.2 53.7,46.2 50.5,40.7 60,46.4 59.4,40.7 47,34.1 47,27 47.6,5.1 29,5.5 19.1,5.9 22.2,22.7 21.3,27.4 3,3.9 5.4,16.3 4.7,21.8 5,28.5 7.9,26.8 18.4,30.2 10.6,18.5 10.3,15 14.5,15 17.4,14.9 13.7,18.3 17.3,18.5 17.3,21.9 13.5,21.9 9.8,21.8
  pour Top (isolate 1.016): 67.45,54.1 67.05,54.5 22.75,54.5 22.45,54.8 22.45,63.9 22.15,64.2 10.85,64.2 8.85,62.2 8.85,39.4 11.15,37.1 68.75,37.1 68.75,53.1 67.75,54.1
  pour Bottom: 67.75,54.7 67.75,37.1 1.25,37.1 1.25,98.8 22.55,98.8 22.55,54.7
  pour Bottom (isolate 0.813): 67.85,35.9 67.85,1.2 67.95,1.1 1.25,1.1 1.25,35.9
  pour Bottom: 11.05,64 21.05,64 21.55,63.5 21.55,51.6 25.65,47.5 25.65,18.9 24.05,17.3 18.05,17.3 16.95,18.4 16.95,42.9 11.05,48.8
  pour Top (isolate 0.813): 67.85,1.2 1.35,1.2 1.35,36 67.95,36 67.95,1.3
GND2  (34 unrouted)
MISO  (1 unrouted)
MOSI  (1 unrouted)
N$1
  Top 0.61: R6.1 23.5,6.51 PWR.C
N$2
  Top 0.61: C1.1 32.95,13.72 34.15,13.72 34.15,12.7 TIMER_555.5
N$3
  Top 0.61: TIMER_555.7 34.1,10.15 32.57,8.62 R1.1 32.48,8.12 R2.2
N$4  (via drill 0.6)
  Top 0.6: v44.95,11.5 44.95,9.9 C2.1 | v29.65,11.5 31.91,11.5 R1.2
  Top 0.61: C2.1 44.4,10.15 TIMER_555.2 | 32.04,11.36 R1.2 TIMER_555.6
  Bottom 0.6: v29.65,11.5 29.75,11.6 44.85,11.6 v44.95,11.5
N$5  (1 unrouted)
N$6  (1 unrouted)
N$7
  Top 0.61: M1B.1 58,9.95 58.05,10 57.66,10 | 57.66,10 R20.2 | M1A.1 58.06,9.6 57.66,10
N$8  (1 unrouted)
N$9
  Top 1.016: Q4.G 29.28,76.02 R7.1
N$10
  Top 0.61: Q1.G 31.99,51.52 R8.1
N$12
  Top 0.61: 1.4 42.38,27.12 42.85,27.6 42.85,33.6 40.5,35.95 14.65,35.95 8.95,41.65 8.95,77.1 10.05,78.2 22.35,78.2 22.85,77.7 22.85,56.6 24.15,55.3 26.83,55.3 R8.2
N$13
  Top 0.61: 1.7 37.44,24.59 37.65,24.8 37.65,33.25 13.1,33.25 6.35,40 6.35,78.8 8.25,80.7 24.34,80.7 R7.2
N$14
  Top 1.016: ZENER_2.C 40.68,18.7 D3.A 43.86,20.3 C10.2
N$15
  Top 1.016: Q3.G 53.18,52.18 R10.1
N$16
  Top 1.016: Q2.G 55.42,76.99 R9.1
N$17  (via drill 0.6)
  Top 0.61: R10.2 53.74,55.6 65.05,55.6 65.05,33.6 v64.95,33.5 | 2.4 65.14,28.68 65.45,29 v65.45,29.4
  Bottom 0.61: v64.95,33.5 64.95,29.9 v65.45,29.4
N$18
  Top 0.61: 2.7 59.99,26.14 60.55,26.7 60.55,30.9 67.55,30.9 67.55,79.8 67.15,80.2 54.25,80.2 52.34,78.29 R9.2
N$19  (1 unrouted)
N$20
  Top 1.016: D6.A 65.38,20.98 65.38,18.75 ZENER_1.C 64.3,17.23 C13.2
N$21  (1 unrouted)
N$22
  Top 4: FUSE.1 15.88,74.02 MAIN.1
  pour Top: 11.05,65.3 22.05,65.3 22.15,65.4 22.15,77.5 10.95,77.5 10.75,77.3 10.75,65.6
N$24  (2 unrouted)
N$25  (2 unrouted)
N$26  (1 unrouted)
N$27  (2 unrouted)
N$28  (1 unrouted)
N$45
  Bottom 0.6: 1A.C 47.48,70.64 1B.A 47.22,70.9 46.95,70.9 46.55,70.5 R34.1
NSS  (1 unrouted)
OSCIN  (2 unrouted)
OSCOUT  (2 unrouted)
PA11  (1 unrouted)
PA12  (2 unrouted)
PB12  (1 unrouted)
PB13  (1 unrouted)
PC13  (1 unrouted)
PC14  (2 unrouted)
PC15  (2 unrouted)
PWM1  (2 unrouted)
PWM_D1  (1 unrouted)
  Top 0.61: 1.1 43.28,23.32 R4.2 45.35,22.7 47.05,21 47.05,14.8 49.35,12.5 49.35,7.15 M1B.2 51.95,4.45 50.26,2.76 9.39,2.76 7.41,4.74 PINHEADER.2
PWM_D2  (1 unrouted)
  Top 0.61: 2.1 65.72,24.88 R3.2 67.35,24.1 67.35,8.55 M1A.2 60.29,1.49 6.31,1.49 PINHEADER.1
RESET  (3 unrouted)
RX  (1 unrouted)
SCK  (1 unrouted)
SCL1  (2 unrouted)
SDA1  (2 unrouted)
SWCLK  (1 unrouted)
SWIO  (1 unrouted)
TIMER  (via drill 0.6)
  Top 0.6: C10.1 45.07,13.3 v45.15,13.3 44.55,13.3 42.67,11.43 | C13.1 60.4,14.82 52.17,14.82 v52.15,14.8
  Top 0.61: TIMER_555.3 42.67,11.43
  Bottom 0.6: v52.15,14.8 46.65,14.8 v45.15,13.3
TX  (1 unrouted)
VB1
  Top 0.61: 1.8 35.26,23.05 C8.1
  Top 1.016: D1.C 31.37,19.55 D3.C 31.96,20.46 C8.1
VB2
  Top 0.61: 2.8 55.37,24.88 C11.1
  Top 1.016: C11.1 54.94,21 D6.C 52.9,21.02 D5.C
VCC  (via drill 0.6)  (1 unrouted)
  Top 0.61: 2.5 57.48,28.68 56.01,30.16 | 56.01,30.16 C12.1 | 56,30.15 56.01,30.16 | 1.5 35.42,27.23 34.12,27.23 32.84,28.5 C9.1 | v35.15,29.5 33.1,29.5 32.81,29.21 | D5.A 51.62,29.9 v49.35,29.9 49.35,26.3 48.35,25.3 48.35,15.9 51.25,13 57.16,13 R20.1 | TIMER_555.4 40.91,12.73 39.48,12.73 39.25,12.5 | 39.25,12.5 38.75,12.01 38.75,9.3 38.34,8.88 TIMER_555.8 35.28,8.41 R2.1 35.32,6.3 C22.1 | 39.25,12.5 36.55,15.2 36.55,19.1 v38.25,20.8
  Top 1.016: D5.A 56,30.15 | D1.A 28.86,29.51 | 32.81,29.21 32.11,29.21 | 32.11,29.21 29.16,29.21 D1.A | 32.11,29.21 C9.1 | D1.A 24.75,25.8 24.75,13.7 C3.+ | 7812.OUT 15.77,7.9
  Top 1.27: 7812.OUT 16.13,8.2 C15.2 21.45,10.34 | 21.45,10.34 22.17,10.34 PWR.A | C3.+ 21.75,10.64 21.45,10.34
  Bottom 0.61: v49.35,29.9 49.15,29.7 38.15,29.7 | 38.15,29.7 35.35,29.7 v35.15,29.5 | v38.25,20.8 38.25,29.6 38.15,29.7